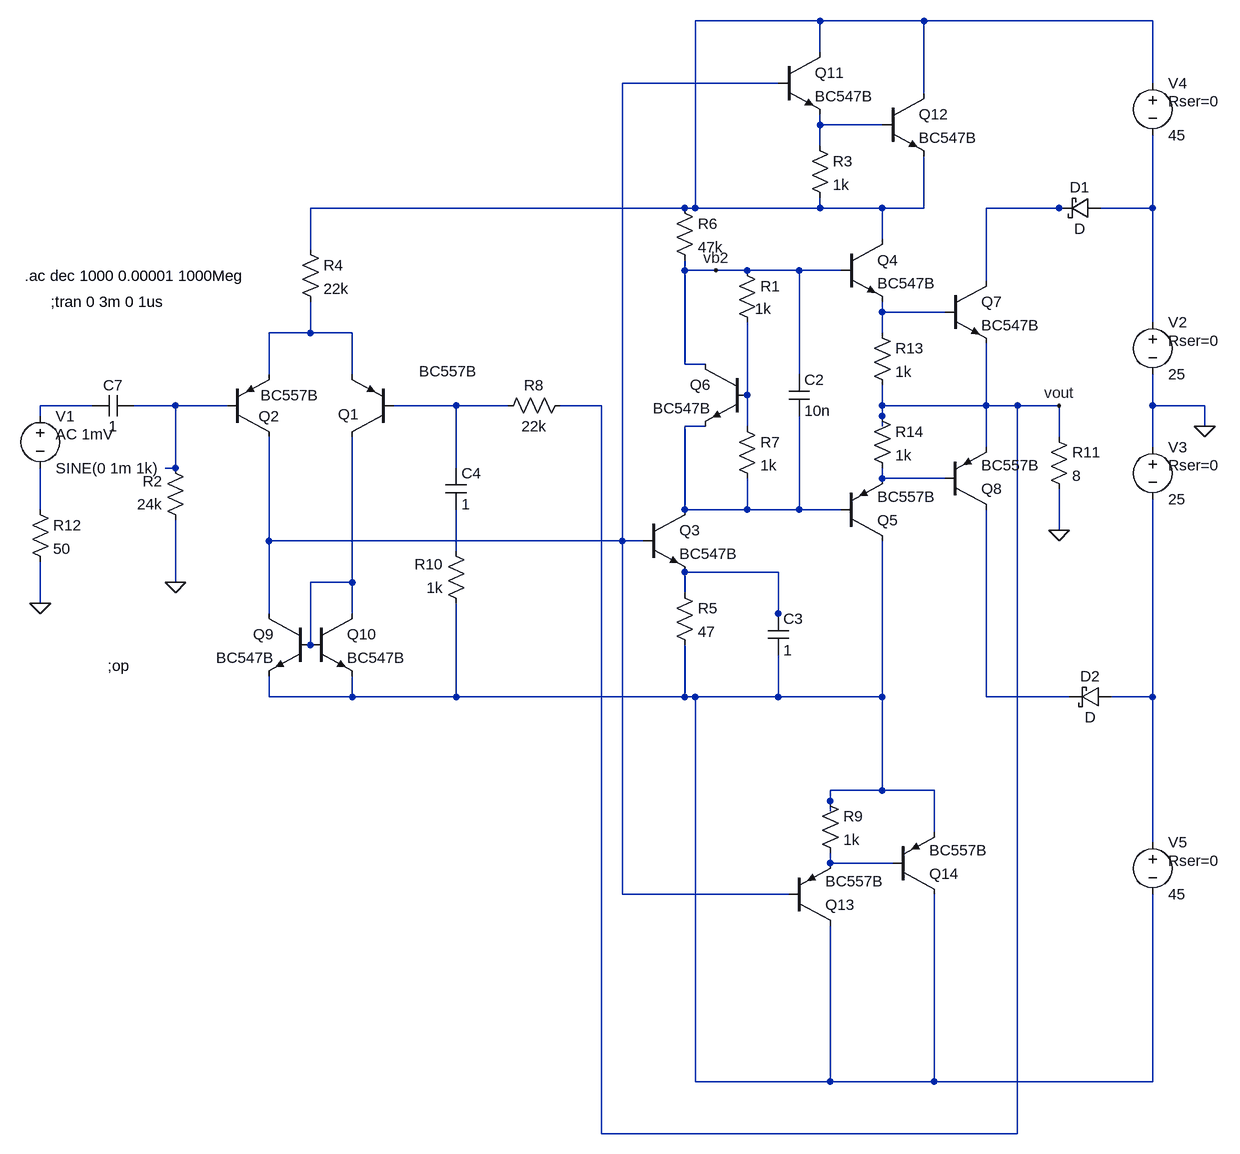
[diagram p0: schematic amplificador con salida clase G.asc]
amplificador con salida clase G.asc, the LTspice schematic file:
Version 4
SHEET 1 1220 916
WIRE -80 -800 -272 -800
WIRE 80 -800 -80 -800
WIRE 432 -800 80 -800
WIRE -80 -752 -80 -800
WIRE -144 -704 -384 -704
WIRE 432 -704 432 -800
WIRE 80 -688 80 -800
WIRE -80 -640 -80 -656
WIRE 16 -640 -80 -640
WIRE -80 -608 -80 -640
WIRE -288 -512 -864 -512
WIRE -272 -512 -272 -800
WIRE -272 -512 -288 -512
WIRE -80 -512 -80 -528
WIRE -80 -512 -272 -512
WIRE 16 -512 -80 -512
WIRE 80 -512 80 -592
WIRE 80 -512 16 -512
WIRE 288 -512 176 -512
WIRE 304 -512 288 -512
WIRE 432 -512 432 -624
WIRE 432 -512 352 -512
WIRE 16 -464 16 -512
WIRE -864 -448 -864 -512
WIRE -288 -416 -288 -432
WIRE -240 -416 -288 -416
WIRE -192 -416 -240 -416
WIRE -112 -416 -192 -416
WIRE -48 -416 -112 -416
WIRE 176 -400 176 -512
WIRE 16 -352 16 -368
WIRE 112 -352 16 -352
WIRE 432 -336 432 -512
WIRE -864 -320 -864 -368
WIRE -864 -320 -928 -320
WIRE -800 -320 -864 -320
WIRE 16 -320 16 -352
WIRE -288 -272 -288 -416
WIRE -256 -272 -288 -272
WIRE -928 -256 -928 -320
WIRE -800 -256 -800 -320
WIRE -112 -256 -112 -416
WIRE -192 -224 -192 -336
WIRE -1200 -208 -1280 -208
WIRE -1072 -208 -1136 -208
WIRE -992 -208 -1072 -208
WIRE -640 -208 -736 -208
WIRE -560 -208 -640 -208
WIRE -416 -208 -480 -208
WIRE 16 -208 16 -240
WIRE 176 -208 176 -304
WIRE 176 -208 16 -208
WIRE 224 -208 176 -208
WIRE 288 -208 224 -208
WIRE 432 -208 432 -256
WIRE 512 -208 432 -208
WIRE -1280 -192 -1280 -208
WIRE 16 -192 16 -208
WIRE -256 -176 -288 -176
WIRE -192 -176 -192 -224
WIRE 16 -176 16 -192
WIRE 512 -176 512 -208
WIRE 288 -160 288 -208
WIRE 176 -144 176 -208
WIRE 432 -144 432 -208
WIRE -1072 -112 -1072 -208
WIRE -1072 -112 -1088 -112
WIRE -640 -112 -640 -208
WIRE 16 -96 16 -112
WIRE 112 -96 16 -96
WIRE -1280 -48 -1280 -112
WIRE -288 -48 -288 -176
WIRE -192 -48 -192 -96
WIRE -192 -48 -288 -48
WIRE -112 -48 -112 -192
WIRE -112 -48 -192 -48
WIRE -48 -48 -112 -48
WIRE 288 -16 288 -80
WIRE -928 0 -928 -160
WIRE -384 0 -384 -704
WIRE -384 0 -928 0
WIRE -352 0 -384 0
WIRE -640 16 -640 -48
WIRE -144 48 -288 48
WIRE -1072 64 -1072 -32
WIRE -800 64 -800 -160
WIRE -800 64 -864 64
WIRE -288 80 -288 48
WIRE -1280 96 -1280 32
WIRE -928 112 -928 0
WIRE -800 112 -800 64
WIRE -144 112 -144 48
WIRE -144 128 -144 112
WIRE -864 160 -864 64
WIRE -928 240 -928 208
WIRE -800 240 -800 208
WIRE -800 240 -928 240
WIRE -640 240 -640 96
WIRE -640 240 -800 240
WIRE -288 240 -288 160
WIRE -288 240 -640 240
WIRE -272 240 -288 240
WIRE -144 240 -144 176
WIRE -144 240 -272 240
WIRE 16 240 16 0
WIRE 16 240 -144 240
WIRE 176 240 176 -48
WIRE 304 240 176 240
WIRE 432 240 432 -64
WIRE 432 240 368 240
WIRE 16 384 16 240
WIRE 16 384 -64 384
WIRE 96 384 16 384
WIRE -64 400 -64 384
WIRE -64 416 -64 400
WIRE 96 448 96 384
WIRE 432 464 432 240
WIRE -64 496 -64 480
WIRE 32 496 -64 496
WIRE -384 544 -384 0
WIRE -128 544 -384 544
WIRE -272 832 -272 240
WIRE -64 832 -64 592
WIRE -64 832 -272 832
WIRE 96 832 96 544
WIRE 96 832 -64 832
WIRE 432 832 432 544
WIRE 432 832 96 832
WIRE -416 912 -416 -208
WIRE 224 912 224 -208
WIRE 224 912 -416 912
FLAG 512 -176 0
FLAG -1072 64 0
FLAG 288 -16 0
FLAG 288 -208 vout
FLAG -240 -416 vb2
FLAG -1280 96 0
SYMBOL res -880 -464 R0
SYMATTR InstName R4
SYMATTR Value 22k
SYMBOL res -1056 -16 R180
WINDOW 0 36 76 Left 2
WINDOW 3 36 40 Left 2
SYMATTR InstName R2
SYMATTR Value 24k
SYMBOL res -304 64 R0
SYMATTR InstName R5
SYMATTR Value 47
SYMBOL res -304 -528 R0
SYMATTR InstName R6
SYMATTR Value 47k
SYMBOL res -464 -224 R90
WINDOW 0 0 56 VBottom 2
WINDOW 3 32 56 VTop 2
SYMATTR InstName R8
SYMATTR Value 22k
SYMBOL res -624 112 R180
WINDOW 0 36 76 Left 2
WINDOW 3 36 40 Left 2
SYMATTR InstName R10
SYMATTR Value 1k
SYMBOL voltage 432 -352 R0
WINDOW 123 0 0 Left 2
WINDOW 39 24 44 Left 2
SYMATTR SpiceLine Rser=0
SYMATTR InstName V2
SYMATTR Value 25
SYMBOL voltage 432 -160 R0
WINDOW 123 0 0 Left 2
WINDOW 39 24 44 Left 2
SYMATTR SpiceLine Rser=0
SYMATTR InstName V3
SYMATTR Value 25
SYMBOL pnp -736 -160 R180
WINDOW 0 53 35 Left 2
WINDOW 3 -128 101 Left 2
SYMATTR InstName Q1
SYMATTR Value BC557B
SYMBOL pnp -992 -160 M180
WINDOW 0 48 32 Left 2
WINDOW 3 51 64 Left 2
SYMATTR InstName Q2
SYMATTR Value BC557B
SYMBOL npn -352 -48 R0
SYMATTR InstName Q3
SYMATTR Value BC547B
SYMBOL npn -48 -464 R0
SYMATTR InstName Q4
SYMATTR Value BC547B
SYMBOL cap -656 -112 R0
SYMATTR InstName C4
SYMATTR Value 1
SYMBOL cap -160 112 R0
SYMATTR InstName C3
SYMATTR Value 1
SYMBOL pnp -48 0 M180
SYMATTR InstName Q5
SYMATTR Value BC557B
SYMBOL npn -192 -272 M0
SYMATTR InstName Q6
SYMATTR Value BC547B
SYMBOL res -208 -432 R0
WINDOW 3 28 75 Left 2
SYMATTR Value 1k
SYMATTR InstName R1
SYMBOL res -208 -192 R0
SYMATTR InstName R7
SYMATTR Value 1k
SYMBOL cap -128 -256 R0
SYMATTR InstName C2
SYMATTR Value 10n
SYMBOL voltage -1280 -208 R0
WINDOW 123 24 44 Left 2
WINDOW 39 0 0 Left 2
SYMATTR Value2 AC 1mV
SYMATTR InstName V1
SYMATTR Value SINE(0 1m 1k)
SYMBOL res -1296 -64 R0
SYMATTR InstName R12
SYMATTR Value 50
SYMBOL cap -1136 -224 R90
WINDOW 0 0 32 VBottom 2
WINDOW 3 32 32 VTop 2
SYMATTR InstName C7
SYMATTR Value 1
SYMBOL npn 112 -400 R0
SYMATTR InstName Q7
SYMATTR Value BC547B
SYMBOL pnp 112 -48 M180
SYMATTR InstName Q8
SYMATTR Value BC557B
SYMBOL res 0 -336 R0
SYMATTR InstName R13
SYMATTR Value 1k
SYMBOL res 0 -208 R0
SYMATTR InstName R14
SYMATTR Value 1k
SYMBOL npn -864 112 M0
SYMATTR InstName Q9
SYMATTR Value BC547B
SYMBOL npn -864 112 R0
SYMATTR InstName Q10
SYMATTR Value BC547B
SYMBOL npn -144 -752 R0
SYMATTR InstName Q11
SYMATTR Value BC547B
SYMBOL npn 16 -688 R0
SYMATTR InstName Q12
SYMATTR Value BC547B
SYMBOL res -96 -624 R0
SYMATTR InstName R3
SYMATTR Value 1k
SYMBOL voltage 432 -720 R0
WINDOW 123 0 0 Left 2
WINDOW 39 24 44 Left 2
SYMATTR SpiceLine Rser=0
SYMATTR InstName V4
SYMATTR Value 45
SYMBOL voltage 432 448 R0
WINDOW 123 0 0 Left 2
WINDOW 39 24 44 Left 2
SYMATTR SpiceLine Rser=0
SYMATTR InstName V5
SYMATTR Value 45
SYMBOL pnp -128 592 M180
SYMATTR InstName Q13
SYMATTR Value BC557B
SYMBOL pnp 32 544 M180
SYMATTR InstName Q14
SYMATTR Value BC557B
SYMBOL res -80 384 R0
SYMATTR InstName R9
SYMATTR Value 1k
SYMBOL schottky 352 -528 R90
WINDOW 0 0 32 VBottom 2
WINDOW 3 32 32 VTop 2
SYMATTR InstName D1
SYMBOL schottky 368 224 R90
WINDOW 0 0 32 VBottom 2
WINDOW 3 32 32 VTop 2
SYMATTR InstName D2
SYMBOL res 272 -176 R0
SYMATTR InstName R11
SYMATTR Value 8
TEXT -1176 192 Left 2 !;op
TEXT -1264 -368 Left 2 !;tran 0 3m 0 1us
TEXT -1304 -408 Left 2 !.ac dec 1000 0.00001 1000Meg

The netlist it stands for:
* amplificador con salida clase G.asc
R4 N001 N007 22k
R2 0 N010 24k
R5 N016 N018 47
R6 N001 vb2 47k
R8 vout N011 22k
R10 N018 N015 1k
V2 N005 0 25 Rser=0
V3 0 N020 25 Rser=0
Q1 N017 N011 N007 0 BC557B
Q2 N002 N010 N007 0 BC557B
Q3 N012 N002 N016 0 BC547B
Q4 N001 vb2 N006 0 BC547B
C4 N011 N015 1
C3 N016 N018 1
Q5 N018 N012 N013 0 BC557B
Q6 vb2 N008 N012 0 BC547B
R1 vb2 N008 1k
R7 N008 N012 1k
C2 vb2 N012 10n
V1 N009 N014 SINE(0 1m 1k) AC 1mV
R12 N014 0 50
C7 N010 N009 1
Q7 N004 N006 vout 0 BC547B
Q8 N019 N013 vout 0 BC557B
R13 N006 vout 1k
R14 vout N013 1k
Q9 N002 N017 N018 0 BC547B
Q10 N017 N017 N018 0 BC547B
Q11 N001 N002 N003 0 BC547B
Q12 N001 N003 N001 0 BC547B
R3 N003 N001 1k
V4 N001 N005 45 Rser=0
V5 N020 N018 45 Rser=0
Q13 N018 N002 N021 0 BC557B
Q14 N018 N021 N018 0 BC557B
R9 N018 N021 1k
D1 N005 N004 D
D2 N020 N019 D
R11 vout 0 8
.model D D
.lib standard.dio
.model NPN NPN
.model PNP PNP
.lib standard.bjt
;op
;tran 0 3m 0 1us
.ac dec 1000 0.00001 1000Meg
.backanno
.end